# Altium schematic sheet PIC18F57Q84_Curiosity_Nano_Debugger.SchDoc
size A3; SheetTitle: Debugger; CompanyName: Microchip Technology Inc.; Organization: Microchip Technology; Address1: 2355 West Chandler Blvd.; Address2: Chandler, AZ  85224; Address4: USA; SheetNumber: 3; SheetTotal: 4; Time: Time
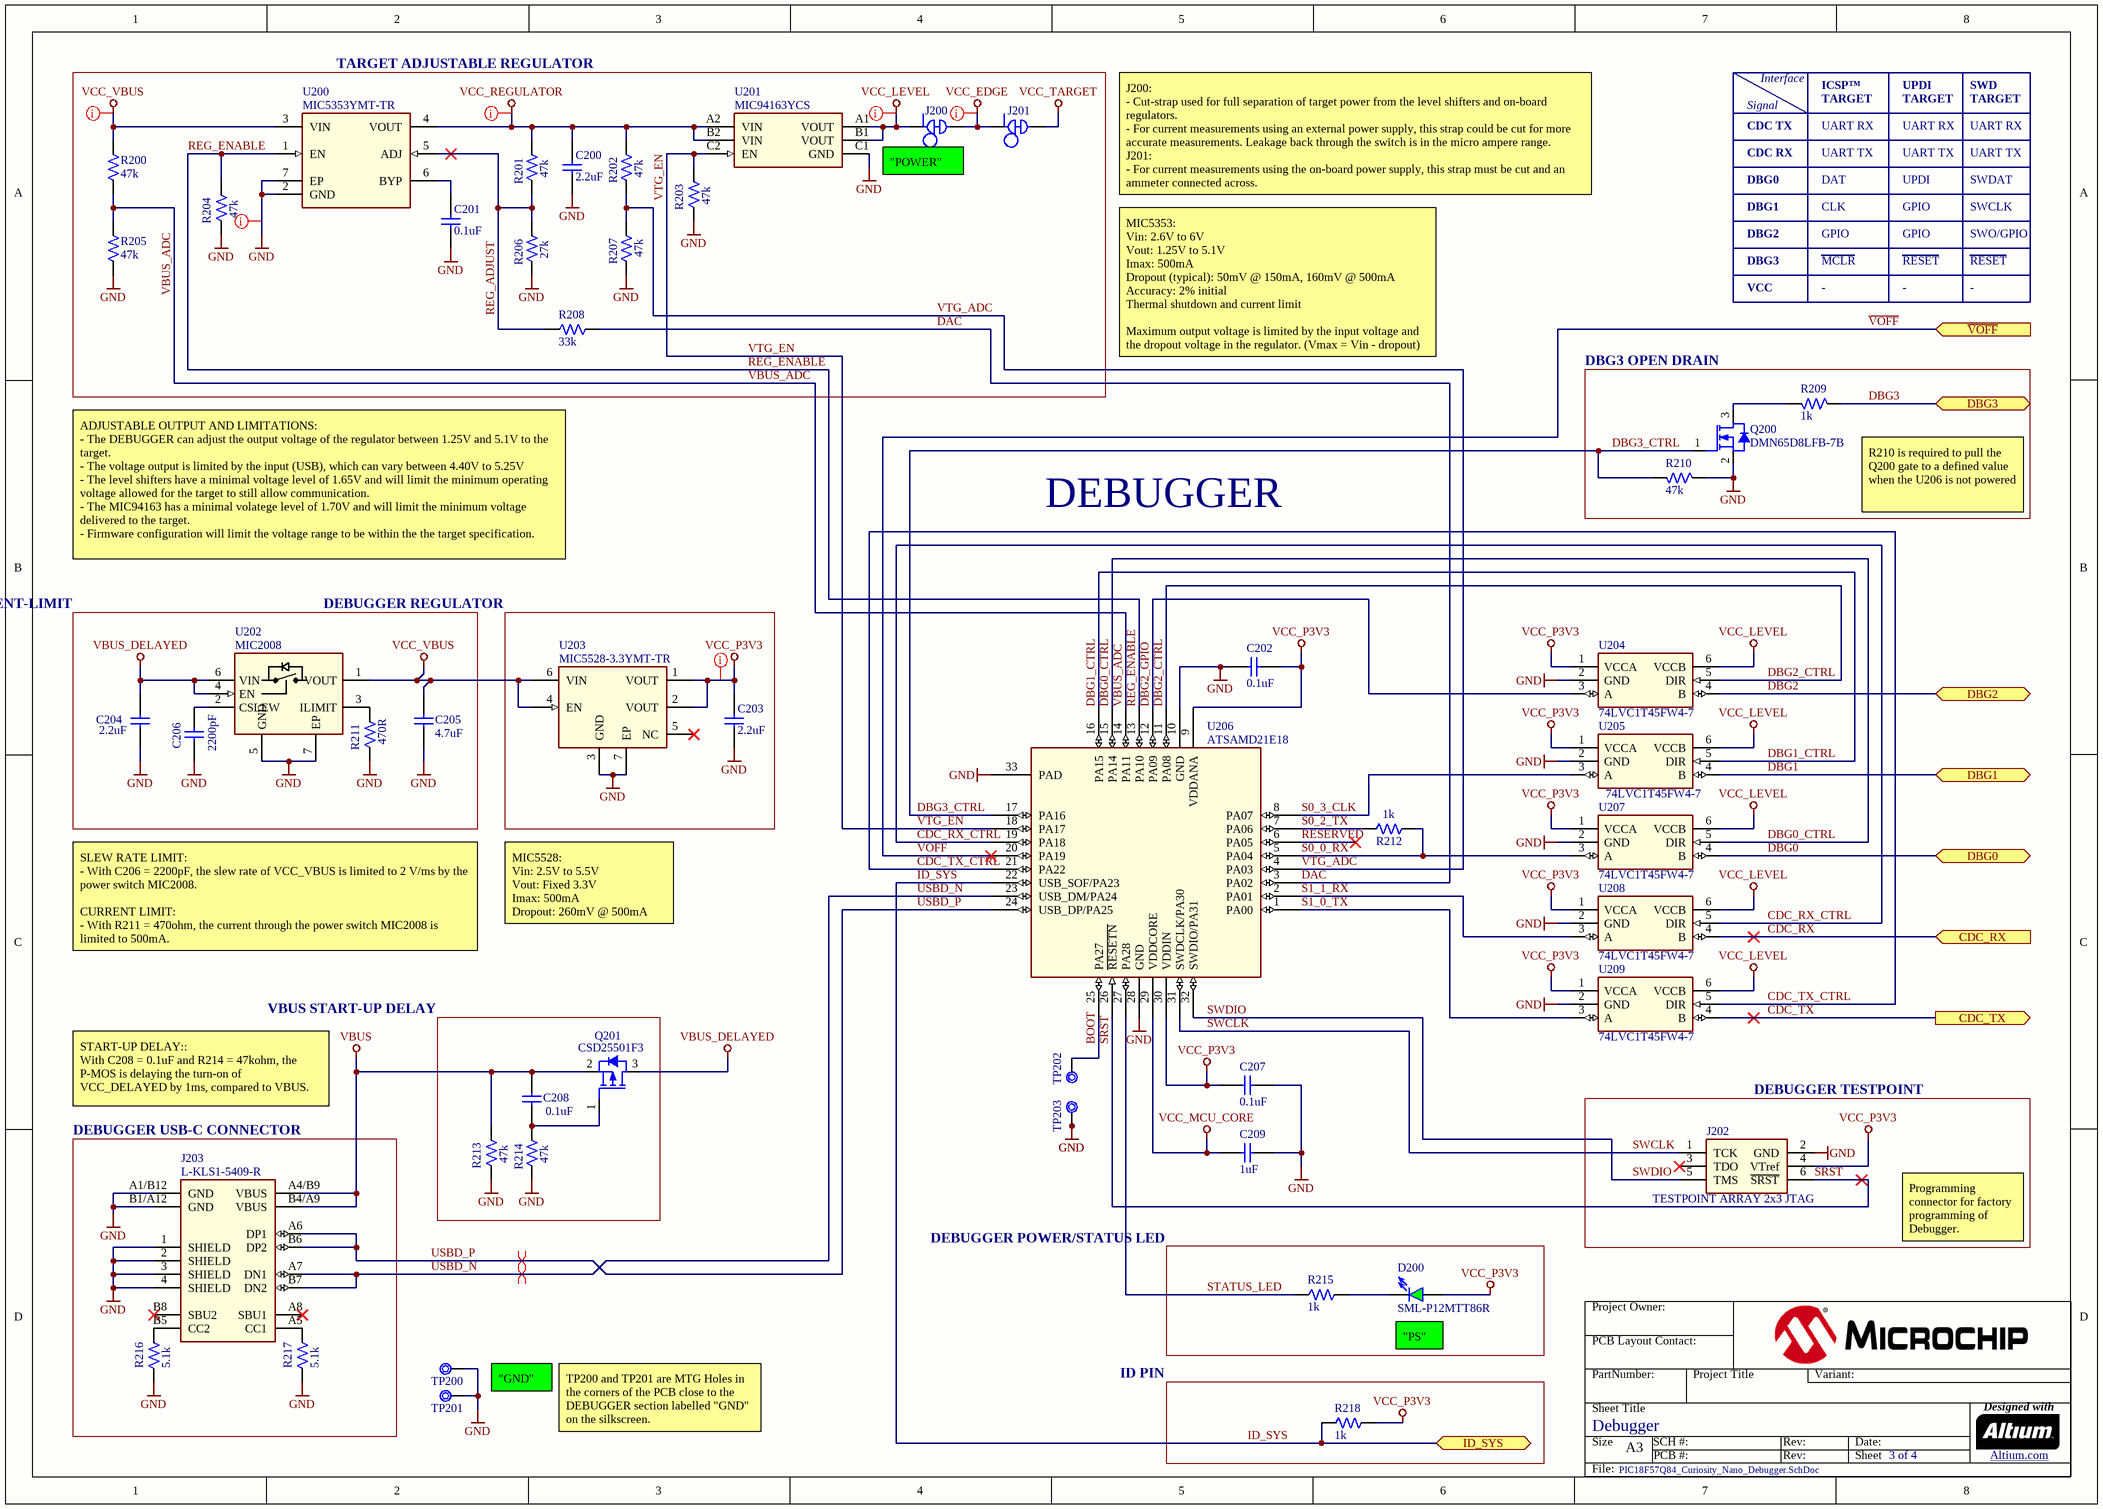
[diagram p0: PIC18F57Q84_Curiosity_Nano_Debugger.SchDoc]

## Parts
C200  value 2.2uF  [CAP_C_0402]  (hidden comment: Capacitor NP)
C201  value 0.1uF  [CAP_C_0402]  (hidden comment: Capacitor NP)
C202  value 0.1uF  [CAP_C_0402]  (hidden comment: Capacitor NP)
C203  value 2.2uF  [CAP_C_0402]  (hidden comment: Capacitor NP)
C204  value 2.2uF  [CAP_C_0402]  (hidden comment: Capacitor NP)
C205  value 4.7uF  [CAP_C_0603]  (hidden comment: Capacitor NP)
C206  value 2200pF  [CAP_C_0402]  (hidden comment: Capacitor NP)
C207  value 0.1uF  [CAP_C_0402]  (hidden comment: Capacitor NP)
C208  value 0.1uF  [CAP_C_0402]  (hidden comment: Capacitor NP)
C209  value 1uF  [CAP_C_0402]  (hidden comment: Capacitor NP)
D200  Manufacturer Part Number 1: SML-P12MTT86R  [LED_0402_GREEN]  (hidden comment: LED_green)
J200  CON JMPR LINK CLOSED  [CON_JMPR_0402_PCB_TRACE_LINK]  (value not drawn)  (net tie, no BOM)
J201  CON JMPR LINK CLOSED  [CON_JMPR_2.54_1x2_TH_PCB_TRACE_LINK]  (value not drawn)  (net tie, no BOM)
J202  value TESTPOINT ARRAY 2x3 JTAG  [TESTPOINT_ARRAY_2x3_1.27mm_pitch_SMD]  (hidden comment: TP ARRAY NO BOM)  (no BOM)
J203  Manufacturer Part Number 1: L-KLS1-5409-R  [CON_USB2.0-C_RCPT_SMD_RA_KLS_KLS1-5409]  (hidden comment: CON USB2.0-C RCPT SMD RA KLS KLS1-5409)
Q200  value DMN65D8LFB-7B  [X1-DFN1006-3]  (hidden comment: Transistor MOS-N GSD)
Q201  value CSD25501F3  [LGA-3_GSD_0.7x0.6_CSD25501F3]  (hidden comment: Transistor MOS-P GSD)
R200  value 47k  [RES_C_0402]  (hidden comment: Resistor)
R201  value 47k  [RES_C_0402]  (hidden comment: Resistor)
R202  value 47k  [RES_C_0402]  (hidden comment: Resistor)
R203  value 47k  [RES_C_0402]  (hidden comment: Resistor)
R204  value 47k  [RES_C_0402]  (hidden comment: Resistor)
R205  value 47k  [RES_C_0402]  (hidden comment: Resistor)
R206  value 27k  [RES_C_0402]  (hidden comment: Resistor)
R207  value 47k  [RES_C_0402]  (hidden comment: Resistor)
R208  value 33k  [RES_C_0402]  (hidden comment: Resistor)
R209  value 1k  [RES_C_0402]  (hidden comment: Resistor)
R210  value 47k  [RES_C_0402]  (hidden comment: Resistor)
R211  value 470R  [RES_C_0402]  (hidden comment: Resistor)
R212  value 1k  [RES_C_0402]  (hidden comment: Resistor)
R213  value 47k  [RES_C_0402]  (hidden comment: Resistor)
R214  value 47k  [RES_C_0402]  (hidden comment: Resistor)
R215  value 1k  [RES_C_0402]  (hidden comment: Resistor)
R216  value 5.1k  [RES_C_0402]  (hidden comment: Resistor)
R217  value 5.1k  [RES_C_0402]  (hidden comment: Resistor)
R218  value 1k  [RES_C_0402]  (hidden comment: Resistor)
TP200  Test Point No BOM  [TP_3.6X2.7]  (value not drawn)  (no BOM)
TP201  Test Point No BOM  [TP_3.6X2.7]  (value not drawn)  (no BOM)
TP202  Test Point No BOM  [CON_TP_0.8dia_SMD_with_Test_Jig_Layer]  (value not drawn)  (no BOM)
TP203  Test Point No BOM  [CON_TP_0.8dia_SMD_with_Test_Jig_Layer]  (value not drawn)  (no BOM)
U200  value MIC5353YMT-TR  [MLF-6 1.6X1.6mm]  (hidden comment: MIC53XX ADJ MLF-6)
U201  value MIC94163YCS  [MIC94163_1.5MM_1MM]  (hidden comment: MIC94163_1.5MM_1MM)
U202  value MIC2008  [VDFN-6_2x2_EP0.8X1.40]  (hidden comment: MIC2008YML-TR VDFN-6)
U203  Manufacturer Part Number 1: MIC5528-3.3YMT-TR  [DFN-6_1.2x1.2]  (hidden comment: MIC5528MT DFN-6)
U204  value 74LVC1T45FW4-7  [X2-DFN1010-6]  (hidden comment: 74LVC(H)1T45 SOT-23-6_SC-70-6_SOT-6_SOT-363_DSBGA)
U205  value 74LVC1T45FW4-7  [X2-DFN1010-6]  (hidden comment: 74LVC(H)1T45 SOT-23-6_SC-70-6_SOT-6_SOT-363_DSBGA)
U206  value ATSAMD21E18  [QFN-32_5X5_EP3.6x3.6_L]  (hidden comment: SAMD21E QFN-32)
U207  value 74LVC1T45FW4-7  [X2-DFN1010-6]  (hidden comment: 74LVC(H)1T45 SOT-23-6_SC-70-6_SOT-6_SOT-363_DSBGA)
U208  value 74LVC1T45FW4-7  [X2-DFN1010-6]  (hidden comment: 74LVC(H)1T45 SOT-23-6_SC-70-6_SOT-6_SOT-363_DSBGA)
U209  value 74LVC1T45FW4-7  [X2-DFN1010-6]  (hidden comment: 74LVC(H)1T45 SOT-23-6_SC-70-6_SOT-6_SOT-363_DSBGA)

## Blocks framed on the sheet
TARGET ADJUSTABLE REGULATOR: C200 C201 J200 J201 R200-R208 U200 U201
DBG3 OPEN DRAIN: Q200 R209 R210
VBUS SLEW RATE- & CURRENT-LIMIT: C204-C206 R211 U202
DEBUGGER REGULATOR: C203 U203
VBUS START-UP DELAY: C208 Q201 R213 R214
DEBUGGER TESTPOINT: J202
DEBUGGER USB-C CONNECTOR: J203 R216 R217
DEBUGGER POWER/STATUS LED: D200 R215
ID PIN: R218

## Ports
CDC_RX (in), CDC_TX (out), DBG0 (bidir), DBG1 (bidir), DBG2 (bidir), DBG3 (bidir), ID_SYS (bidir), ~{VOFF} (in)

## Nets
GND: C200.1 C201.2 C202.1 C203.1 C204.1 C205.1 C206.1 C207.2 C209.1 J202.2(GND) J203.1(SHIELD) J203.2(SHIELD) J203.3(SHIELD) J203.4(SHIELD) J203.A1/B12(GND) J203.B1/A12(GND) Q200.2(S) R203.2 R204.2 R205.1 R206.1 R207.1 R210.2 R211.2 R213.2 R214.2 R216.2 R217.2 TP200.1 TP201.1 TP203.1 U200.2(GND) U200.7(EP) U201.C1(GND) U202.5(GND) U202.7(EP) U203.3(GND) U203.7(EP) U204.2(GND) U205.2(GND) U206.10(GND) U206.28(GND) U206.33(PAD) U207.2(GND) U208.2(GND) U209.2(GND)
VBUS: C208.2 J203.A4/B9(VBUS) J203.B4/A9(VBUS) Q201.2(S) R213.1
VBUS_DELAYED: C204.2 Q201.3(D) U202.4(EN) U202.6(VIN)
VCC_EDGE: J200.2 J201.1
VCC_LEVEL: J200.1 U201.A1(VOUT) U201.B1(VOUT) U204.6(VCCB) U205.6(VCCB) U207.6(VCCB) U208.6(VCCB) U209.6(VCCB)
VCC_MCU_CORE: C209.2 U206.29(VDDCORE)
VCC_P3V3: C202.2 C203.2 C207.1 D200.1(A) J202.4(VTref) R218.2 U203.1(VOUT) U203.2(VOUT) U204.1(VCCA) U205.1(VCCA) U206.9(VDDANA) U206.30(VDDIN) U207.1(VCCA) U208.1(VCCA) U209.1(VCCA)
VCC_REGULATOR: C200.2 R201.1 R202.2 U200.4(VOUT) U201.A2(VIN) U201.B2(VIN)
VCC_TARGET: J201.2
VCC_VBUS: C205.2 R200.1 U200.3(VIN) U202.1(VOUT) U203.4(EN) U203.6(VIN)
BOOT: TP202.1 U206.25(PA27)
CDC_RX: U208.4(B) ; port CDC_RX
CDC_RX_CTRL: U206.19(PA18) U208.5(DIR)
CDC_TX: U209.4(B) ; port CDC_TX
CDC_TX_CTRL: U206.21(PA22) U209.5(DIR)
DAC: R208.2 U206.3(PA02)
DBG0: U207.4(B) ; port DBG0
DBG0_CTRL: U206.15(PA14) U207.5(DIR)
DBG1: U205.4(B) ; port DBG1
DBG1_CTRL: U205.5(DIR) U206.16(PA15)
DBG2: U204.4(B) ; port DBG2
DBG2_CTRL: U204.5(DIR) U206.11(PA08)
DBG2_GPIO: U204.3(A) U206.12(PA09)
DBG3: R209.2 ; port DBG3
DBG3_CTRL: Q200.1(G) R210.1 U206.17(PA16)
ID_SYS: R218.1 U206.22(USB_SOF/PA23) ; port ID_SYS
REG_ADJUST: R201.2 R206.2 R208.1 U200.5(ADJ)
REG_ENABLE: R204.1 U200.1(EN) U206.13(PA10)
RESERVED: U206.6(PA05)
S0_0_RX: R212.1 U206.5(PA04) U207.3(A)
S0_2_TX: R212.2 U206.7(PA06)
S0_3_CLK: U205.3(A) U206.8(PA07)
S1_0_TX: U206.1(PA00) U209.3(A)
S1_1_RX: U206.2(PA01) U208.3(A)
~{SRST}: J202.6(~{SRST}) U206.26(~{RESETN})
STATUS_LED: R215.2 U206.27(PA28)
SWCLK: J202.1(TCK) U206.31(SWDCLK/PA30)
SWDIO: J202.5(TMS) U206.32(SWDIO/PA31)
USBD_N: J203.A7(DN1) J203.B7(DN2) U206.23(USB_DM/PA24)
USBD_P: J203.A6(DP1) J203.B6(DP2) U206.24(USB_DP/PA25)
~{VOFF}: U206.20(PA19) ; port ~{VOFF}
VBUS_ADC: R200.2 R205.2 U206.14(PA11)
VTG_ADC: R202.1 R207.2 U206.4(PA03)
VTG_EN: R203.1 U201.C2(EN) U206.18(PA17)
NetC201_1: C201.1 U200.6(BYP)
NetC206_2: C206.2 U202.2(CSLEW)
NetC208_1: C208.1 Q201.1(G) R214.1
NetD200_2: D200.2(K) R215.1
NetJ203_A5: J203.A5(CC1) R217.1
NetJ203_B5: J203.B5(CC2) R216.1
NetQ200_3: Q200.3(D) R209.1
NetR211_1: R211.1 U202.3(ILIMIT)

Not connected (* = marked no-connect by the designer): J202 3(TDO)*; J203 A8(SBU1)* B8(SBU2)*; U203 5(NC)*

## Layout directives
net class Power: GND, VCC_EDGE, VCC_LEVEL, VCC_P3V3, VCC_REGULATOR, VCC_VBUS
differential pair: USBD_N, USBD_P

## Notes on the sheet
- Signal
- Interface
- ICSP™
- TARGET
- UPDI
- SWD
- (near J200) "POWER"
- CDC TX
- CDC RX
- DBG0
- UART RX
- UART TX
- DAT
- SWDAT
- J200:
  - Cut-strap used for full separation of target power from the level shifters and on-board regulators.
  - For current measurements using an external power supply, this strap could be cut for more accurate measurements. Leakage back through the switch is in the micro ampere range.
  J201:
  - For current measurements using the on-board power supply, this strap must be cut and an ammeter connected across.
- DBG1
- DBG2
- CLK
- GPIO
- SWCLK
- SWO/GPIO
- DBG3
- VCC
- MCLR
- -
- RESET
- MIC5353:
  Vin: 2.6V to 6V
  Vout: 1.25V to 5.1V
  Imax: 500mA
  Dropout (typical): 50mV @ 150mA, 160mV @ 500mA
  Accuracy: 2% initial
  Thermal shutdown and current limit
  Maximum output voltage is limited by the input voltage and the dropout voltage in the regulator. (Vmax = Vin - dropout)
- DEBUGGER
- (near R209) R210 is required to pull the Q200 gate to a defined value when the U206 is not powered
- ADJUSTABLE OUTPUT AND LIMITATIONS:
  - The DEBUGGER can adjust the output voltage of the regulator between 1.25V and 5.1V to the target.
  - The voltage output is limited by the input (USB), which can vary between 4.40V to 5.25V
  - The level shifters have a minimal voltage level of 1.65V and will limit the minimum operating voltage allowed for the target to still allow communication.
  - The MIC94163 has a minimal volatege level of 1.70V and will limit the minimum voltage delivered to the target.
  - Firmware configuration will limit the voltage range to be within the the target specification.
- MIC5528:
  Vin: 2.5V to 5.5V
  Vout: Fixed 3.3V
  Imax: 500mA
  Dropout: 260mV @ 500mA
- SLEW RATE LIMIT:
  - With C206 = 2200pF, the slew rate of VCC_VBUS is limited to 2 V/ms by the power switch MIC2008.
  CURRENT LIMIT:
  - With R211 = 470ohm, the current through the power switch MIC2008 is limited to 500mA.
- START-UP DELAY::
  With C208 = 0.1uF and R214 = 47kohm, the P-MOS is delaying the turn-on of VCC_DELAYED by 1ms, compared to VBUS.
- Programming connector for factory programming of Debugger.
- "GND"
- (near D200) "PS"
- TP200 and TP201 are MTG Holes in the corners of the PCB close to the DEBUGGER section labelled "GND" on the silkscreen.
- Project Owner:
- PCB Layout Contact:
- PartNumber:
- Project Title
- Variant:
- Sheet Title
- Size
- A3
- SCH #:
- PCB #:
- Rev:
- Date:
- Sheet
- Designed with
- Altium.com <http://go.altium.com/MicrochipLandingPage_Evaluation.html>
- File:

## Library data of the parts
C200 C203 C204 = CAP1208: Manufacturer 1: Murata; Manufacturer Part Number 1: GRM155R61A225KE95D; Voltage: 10V; Description_: CAP CER 2.2uF 10V 10% X5R SMD 0402; Tolerance: 10%; Type: Ceramic; Populated: YES; Temperature Coefficient: X5R; Restricted Sourcing: No; Package: 0402; Revision: 4; Symbol: Capacitor NP; Category: Capacitor; Supplier 1: Murata; Supplier Part Number 1: GRM155R61A225KE95D; Operating Temperature: -55C to +85C; Manufacturer 2: Samsung Electro-Mechanics; Manufacturer Part Number 2: CL05A225KP5NSNC; Supplier 2: Samsung Electro-Mechanics; Supplier Part Number 2: CL05A225KP5NSNC
C201 C202 C207 C208 = CAP1033: Manufacturer 1: KEMET; Manufacturer Part Number 1: C0402C104K4RAC7867; Voltage: 16V; Description_: CAP CER 0.1uF 16V 10% X7R SMD 0402; Tolerance: 10%; Type: Ceramic; Populated: Yes; Temperature Coefficient: X7R; Restricted Sourcing: No; Package: 0402; Revision: 11; Symbol: Capacitor NP; Operating Temperature: -55C to +125C; Category: Capacitor; Manufacturer 2: Samsung Electro-Mechanics; Manufacturer Part Number 2: CL05B104KO5NNNC; Supplier 1: Digi-Key; Supplier Part Number 1: 399-C0402C104K4RAC7867TR-ND; Supplier 2: Digi-Key; Supplier Part Number 2: 1276-1001-1-ND; Manufacturer 3: Würth Elektronik; Manufacturer Part Number 3: 885012205037; Supplier 3: Digi-Key; Supplier Part Number 3: 732-7532-1-ND; Manufacturer 4: Samsung Electro-Mechanics; Manufacturer Part Number 4: CL05B104KO5NNND; Manufacturer 5: Samsung Electro-Mechanics; Manufacturer Part Number 5: CL05B104KO5NNNO; Manufacturer 6: Yageo; Manufacturer Part Number 6: CC0402KRX7R7BB104; Supplier 4: Mouser; Supplier Part Number 4: 187-CL05B104KO5NNND; Supplier 5: Samsung Electro-Mechanics; Supplier Part Number 5: CL05B104KO5NNNO; Supplier 6: Yageo; Supplier Part Number 6: CC0402KRX7R7BB104
C205 = CAP0543: Manufacturer 1: KEMET; Manufacturer Part Number 1: C0603C475K8PAC7867; Voltage: 10V; Description_: CAP CER 4.7uF 10V 10% X5R SMD 0603; Tolerance: 10%; Type: Ceramic; Populated: Yes; Temperature Coefficient: X5R; Restricted Sourcing: No; Package: 0603; Revision: 6; Symbol: Capacitor NP; Operating Temperature: -55C to +85C; Category: Capacitor; Manufacturer 2: Taiyo Yuden; Manufacturer Part Number 2: LMK107BJ475KA-T; Manufacturer 3: Samsung Electro-Mechanics; Manufacturer Part Number 3: CL10A475KP8NNNC; Supplier 1: Digi-Key; Supplier Part Number 1: 399-C0603C475K8PAC7867CT-ND; Supplier 2: Digi-Key; Supplier Part Number 2: 587-1441-1-ND; Supplier 3: Samsung Electro-Mechanics; Supplier Part Number 3: CL10A475KP8NNNC
C206 = CAP1265: Manufacturer 1: KEMET; Manufacturer Part Number 1: C0402C222J3GACTU; Voltage: 25V; Description_: CAP CER 2200pF 25V 5% C0G SMD 0402; Tolerance: 5%; Type: Ceramic; Populated: YES; Temperature Coefficient: C0G; Restricted Sourcing: No; Package: 0402; Revision: 1; Symbol: Capacitor NP; Operating Temperature: -55C to +125C; Category: Capacitor; Supplier 1: Digi-Key; Supplier Part Number 1: 399-8957-1-ND
C209 = CAP0616: Manufacturer 1: KEMET; Manufacturer Part Number 1: C0402C105K9PACTU; Voltage: 6.3V; Description_: CAP CER 1uF 6.3V 10% X5R SMD 0402; Tolerance: 10%; Type: Ceramic; Populated: Yes; Temperature Coefficient: X5R; Restricted Sourcing: No; Package: 0402; Revision: 5; Symbol: Capacitor NP; Operating Temperature: -55C to +85C; Category: Capacitor; Manufacturer 2: Kemet; Manufacturer Part Number 2: C0402C105K9PAC7867; Supplier 1: Digi-Key; Supplier Part Number 1: 399-4873-1-ND; Supplier 2: Digi-Key; Supplier Part Number 2: 399-C0402C105K9PAC7867TR-ND
D200 = LED1092: LED; Manufacturer 1: Rohm Semiconductor; Value: LED SINGLE SML-P12MTT86R YELLOW-GREEN; Description_: DIO LED YELLOW-GREEN 2.2V 20mA 25mcd Clear SMD 0402; Type: LED Single; Forward Current: 20mA; Power: 54mW; Reverse Current: 10uA; Reverse Voltage: 5V; Populated: YES; Restricted Sourcing: No; Revision: 1; Symbol: LED_green; Package: 0402; Operating Temperature: -40C to +85C; Category: Diode; Supplier 1: Rohm Semiconductor; Supplier Part Number 1: SML-P12MTT86R
J200 = CON2116: Value: CON 0402 PCB TRACE LINK; Description_: CON JUMPER 0402 CLOSED PCB TRACE LINK MANUAL CUT; Populated: DNP; Restricted Sourcing: No; Revision: 1; Symbol: CON JMPR LINK CLOSED; Category: Connector; Assembly Type: Mechanical
J201 = CON2118: Value: CON JMPR 1x2 PCB TRACE LINK; Description_: CON JUMPER-2.54 1x2 PCB TRACE LINK MANUAL CUT; Populated: DNP; Restricted Sourcing: No; Revision: 1; Symbol: CON JMPR LINK CLOSED; Type: Header 2.54mm; Category: Connector; Assembly Type: Mechanical
J202 = CON2119: Description_: CON TP ARRAY 2x3 1.27mm pitch JTAG; Populated: DNP; Revision: 1; Symbol: TESTPOINT ARRAY 2x3 JTAG; Type: Header 1.27mm; Category: Connector; Assembly Type: SMD; Restricted Sourcing: No
J203 = CON2580: Manufacturer 1: KLS Electronic; Value: USB2.0 Type-C FEMALE; Description_: CON USB2.0 Type-C Female SMD R/A; Voltage: 100V AC; Current: 5A; Populated: YES; Restricted Sourcing: No; Revision: 2; Symbol: CON USB2.0-C RCPT SMD RA KLS KLS1-5409; Type: USB; Category: Connector; Supplier 1: Cabcon A/S; Supplier Part Number 1: L-KLS1-5409-R; Operating Temperature: -30C to +85C; Assembly Type: SMD
Q200 = TRA1340: Transistor MOS; Manufacturer 1: Diodes Incorporated; Manufacturer Part Number 1: DMN65D8LFB-7; Description_: TRANS FET N-CH DMN65D8LFB-7B 260mA 60V 430mW X1_DFN1006-3; Type: FET; Current: 260mA; Drain to Source Voltage: 60V; Power: 430mW; Populated: YES; Restricted Sourcing: No; Revision: 3; Symbol: Transistor MOS-N GSD; Package: X1-DFN1006-3; Category: Transistor; Voltage: 60V; Supplier 1: Digi-Key; Supplier Part Number 1: DMN65D8LFB-7DITR-ND; Manufacturer 2: Diodes Incorporated; Manufacturer Part Number 2: DMN65D8LFB-7B; Supplier 2: Digi-Key; Supplier Part Number 2: DMN65D8LFB-7BDICT-ND
Q201 = TRA1611: Transistor MOS; Manufacturer 1: Texas Instruments; Description_: TRANS FET P-CH CSD25501F3 -20V -3.6A 0.076R LGA; Type: FET; Current: -3.6A; Drain to Source Voltage: -20V; Populated: YES; Restricted Sourcing: No; Revision: 1; Symbol: Transistor MOS-P GSD; Package: LGA; Operating Temperature: -55C to +150C; Category: Transistor; Gate to Source Voltage: -20V; Voltage: -20V; Manufacturer Part Number 1: CSD25501F3; Manufacturer 2: Texas Instruments; Manufacturer Part Number 2: CSD25501F3T; Supplier 1: Digi-Key; Supplier Part Number 1: 296-51017-2-ND; Supplier 2: Digi-Key; Supplier Part Number 2: 296-47556-2-ND
R200-R205 R207 R210 R213 R214 = RES2662: Manufacturer 1: Yageo; Manufacturer Part Number 1: RC0402FR-0747KL; Tolerance: 1%; Description_: RES TKF 47k 1% 1/16W SMD 0402; Voltage: 50V; Populated: YES; Restricted Sourcing: No; Package: 0402; Revision: 3; Symbol: Resistor; Category: Resistor; Type: RES SMD; Composition: TKF; Supplier 1: Digi-Key; Supplier Part Number 1: 311-47.0KLRCT-ND
R206 = RES2661: Manufacturer 1: Yageo; Manufacturer Part Number 1: RC0402FR-0727KL; Tolerance: 1%; Description_: RES TKF 27k 1% 1/16W SMD 0402; Populated: YES; Voltage: 50V; Restricted Sourcing: No; Package: 0402; Revision: 3; Symbol: Resistor; Category: Resistor; Type: RES SMD; Composition: TKF; Supplier 1: Digi-Key; Supplier Part Number 1: 311-27.0KLRCT-ND
R208 = RES1994: Manufacturer 1: Yageo; Manufacturer Part Number 1: AC0402FR-0733KL; Tolerance: 1%; Description_: RES TKF 33k 1% 1/16W SMD 0402; Power: 1/16W; Populated: YES; Temperature Coefficient: 100ppm/C; Restricted Sourcing: No; Package: 0402; Revision: 2; Symbol: Resistor; Operating Temperature: -55C to +155C; Category: Resistor; Type: RES SMD; Composition: TKF; Supplier 1: Digi-Key; Supplier Part Number 1: YAG3477CT-ND
R209 R212 R215 R218 = RES1022: Manufacturer 1: Panasonic; Manufacturer Part Number 1: ERJ-2RKF1001X; Tolerance: 1%; Description_: RES TKF 1k 1% 1/10W SMD 0402; Voltage: 50V; Power: 1/10W; Populated: YES; Temperature Coefficient: 100ppm/C; Package: 0402; Revision: 3; Symbol: Resistor; Operating Temperature: -55C to +155C; Category: Resistor; Type: RES SMD; Composition: TKF; Supplier 1: Digi-Key; Supplier Part Number 1: P1.00KLTR-ND
R211 = RSMT1163: Manufacturer 1: Yageo; Manufacturer Part Number 1: RC0402FR-07470RL; Tolerance: 1%; Description_: RES TKF 470R 1% 1/16W MF 0402; Populated: YES; Restricted Sourcing: No; Package: 0402; Revision: 2; Symbol: resistor; Category: Resistor; Type: RES SMD; Supplier 1: Digi-Key; Supplier Part Number 1: 311-470LRCT-ND
R216 R217 = RES1655: Manufacturer 1: Panasonic Electronic Components; Manufacturer Part Number 1: ERJ-2RKF5101X; Tolerance: 1%; Description_: RES TKF 5.1k 1% 1/10W SMD 0402; Temperature Coefficient: 100ppm/C; Power: 1/10W; Populated: YES; Package: 0402; Revision: 1; Symbol: Resistor; Operating Temperature: -55C to +155C; Category: Resistor; Type: RES SMD; Composition: TKF; Supplier 1: Digi-Key; Supplier Part Number 1: P5.10KLCT-ND
TP200 TP201 = CON2131: Test Point; Value: TP TH D3.6H2.7; Description_: CON TP PAD PCB TH D3.6H2.7; Populated: Yes; Revision: 1; Symbol: Test Point No Bom; Type: Test Point No BOM; Category: Connector; Assembly Type: TH; Restricted Sourcing: No
TP202 TP203 = CON2120: Test Point; Value: TP SMD D0.8; Description_: CON TP PAD PCB SMD D0.8; Populated: DNP; Revision: 1; Symbol: Test Point No BOM; Type: Test Point No BOM; Category: Connector; Assembly Type: SMD; Restricted Sourcing: No
U200 = MIC7389: LDO Regulator; Manufacturer 1: Microchip Technology; Description_: MCHP ANALOG LDO ADJ 500mA MIC5353YMT-TR MLF-6; Populated: YES; Restricted Sourcing: No; Symbol: MIC53XX ADJ MLF-6; Type: LDO; Revision: 2; Category: MCHP-Analog; Manufacturer Part Number 1: MIC5353YMT-TR; Supplier 1: Digi-Key; Supplier Part Number 1: 576-3681-1-ND; Operating Temperature: -40C to +125C
U201 = MIC8744: Manufacturer 1: Microchip Technology; Manufacturer Part Number 1: MIC94163YCS-TR; Description_: IC LOAD SWITCH HI SIDE 3A 6WLCSP; Populated: YES; Restricted Sourcing: No; Symbol: MIC94163_1.5MM_1MM; Type: Power Switch; Revision: 1; Category: MCHP-Analog; Supplier 1: Digi-Key; Supplier Part Number 1: 576-4454-2-ND; Operating Temperature: -40C to +125C
U202 = MIC9604: Manufacturer 1: Microchip Technology; Description_: MCHP ANALOG POWER SWITCH 5.5V 2.1A MIC2008YML-TR VDFN-6; Populated: YES; Restricted Sourcing: No; Symbol: MIC2008YML-TR VDFN-6; Type: Power Switch; Revision: 1; Category: MCHP-Analog; Manufacturer Part Number 1: MIC2008YML-TR; Supplier 1: Digi-Key; Supplier Part Number 1: 576-2591-2-ND; Operating Temperature: -40C to +85C; Supplier 2: Microchip Technology; Supplier Part Number 2: MIC2008YML-TR
U203 = MIC6905: Manufacturer 1: Microchip Technology; Value: MIC5528 3V3; Description_: MCHP ANALOG LDO 3.3V MIC5528-3.3YMT-TR 6-TDFN; Populated: YES; Symbol: MIC5528MT DFN-6; Type: LDO; Revision: 3; Category: MCHP-Analog; Supplier 1: Digi-Key; Supplier Part Number 1: 576-4766-1-ND; Operating Temperature: -40C to +125C; Manufacturer 2: Microchip Technology; Manufacturer Part Number 2: MIC5528-3.3YMT-T5; Supplier 2: Microchip Technology; Supplier Part Number 2: MIC5528-3.3YMT-T5
U204 U205 U207-U209 = IC1665: Manufacturer 1: Diodes Incorporated; Description_: IC VOLTAGE TRANSLATOR BI-DIR 1 CIRCUIT 74LVC1T45FW4-7 X2-DFN1010-6; Populated: YES; Restricted Sourcing: No; Revision: 2; Symbol: 74LVC(H)1T45 SOT-23-6_SC-70-6_SOT-6_SOT-363_DSBGA; Type: Translator; Category: IC; Manufacturer Part Number 1: 74LVC1T45FW4-7; Supplier 1: Digi-Key; Supplier Part Number 1: 74LVC1T45FW4-7DICT-ND
U206 = MIC8641: Manufacturer 1: Microchip Technology; Manufacturer Part Number 1: ATSAMD21E18A-MUT; Description_: MCHP MCU 32-BIT 48MHz 256Kb 32Kb ATSAMD21E18A-MUT QFN-32; Populated: YES; Restricted Sourcing: No; Symbol: SAMD21E QFN-32; Type: 32-Bit MPU; Revision: 3; Category: MCHP-Microcontroller; Supplier 1: Digi-Key; Supplier Part Number 1: ATSAMD21E18A-MUTCT-ND; Operating Temperature: -40C to +85C